# Altium schematic sheet 1_P0_MCU_extend.schdoc
size 307 x 218 mm; Symbol: Sheet-Symbol_A4; Device: Sheet-Symbol_A4; @Project Name: modular_design; @Page Count: 7; @Update Date: 2026-07-07; @Create Date: 2026-06-22; @Schematic Name: Schematic1; @Page No: 1; @Page Name: P0_MCU_extend; @Board Name: Board1; Company: 嘉立创EDA; Version: V1.0; Page Size: A4; Convert to PCB: yes; Add into BOM: yes; Title Block Position: 3; Width: 1170; Height: 825; Region Start: 1; X Region Count: 6; Y Region Count: 4; Blade Width: 10; @Create Time: 05:46:34; @Update Time: 16:45:46
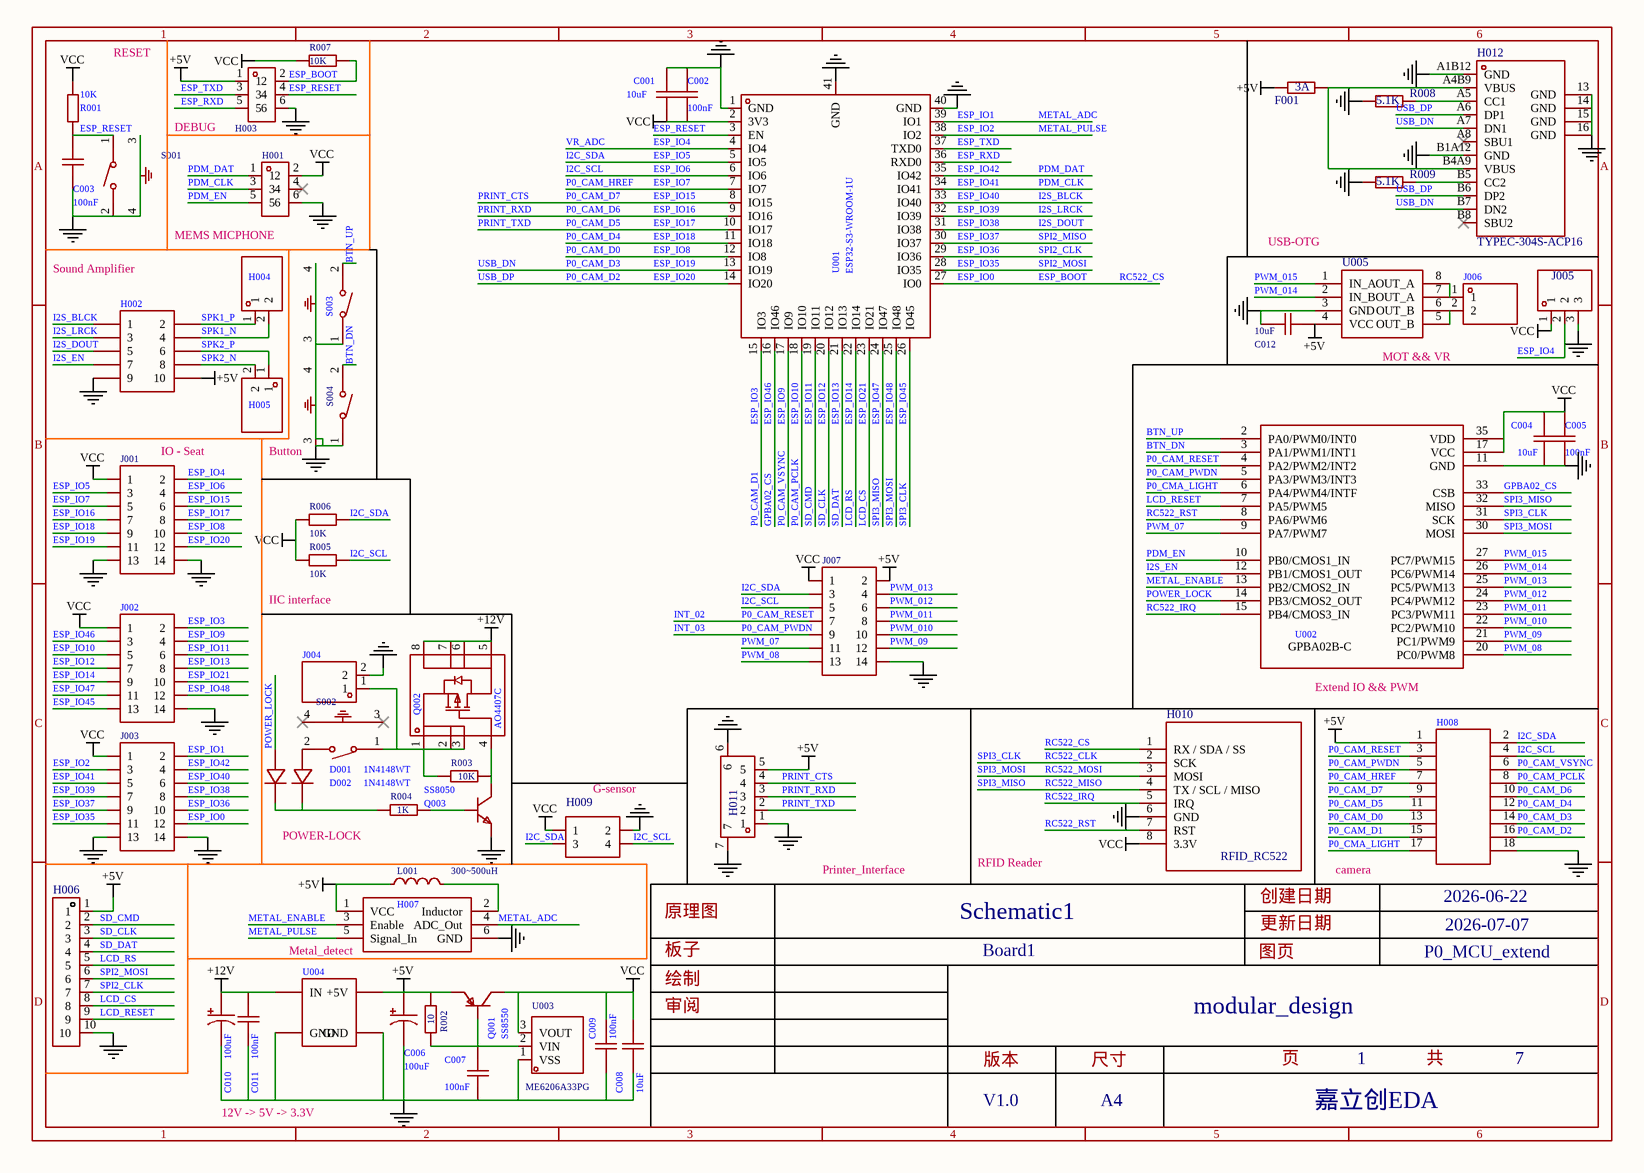
[diagram p0: 1_P0_MCU_extend.schdoc]

## Parts
C001  10uF  [C0805]
C002  100nF  [C0603]
C003  100nF  [C0603]
C004  10uF  [C0805]
C005  100nF  [C0603]
C006  100uF  [CAP-SMD_BD6.3-L6.6-W6.6-LS7.2-R-RD]
C007  100nF  [C0805]
C008  10uF  [C0805]
C009  100nF  [C0805]
C010  100uF  [CAP-SMD_BD6.3-L6.6-W6.6-LS7.2-R-RD]
C011  100nF  [C0805]
C012  10uF  [C0805]
D001  1N4148WT  [SOD-523_L1.2-W0.8-LS1.6-RD]
D002  1N4148WT  [SOD-523_L1.2-W0.8-LS1.6-RD]
F001  3A  [R0805]
H001  PZ254V-12-6P  [PDM_MODULE]  (value not drawn)
H002  (no value)  [I2S_HT517_STEREO]
H003  PZ254V-12-6P  [CH343_DEBUG]  (value not drawn)
H004  B2B-ZR(LF)(SN)  [CONN-TH_B2B-ZR-LF-SN]  (value not drawn)
H005  B2B-ZR(LF)(SN)  [CONN-TH_B2B-ZR-LF-SN]  (value not drawn)
H006  (no value)  [connector_p10_1.5mm]
H007  (no value)  [Metal_Detect]
H008  (no value)  [connector_p2*9_2.54]
H009  A2541HWV-2x2P  [SC7A20_MODULE]  (value not drawn)
H010  (no value)  [RFID_RC522]
H011  HX20007-5AWB  [CONN-SMD_5P-P2.00_HX20007-5AWB]  (value not drawn)
H012  TYPEC-304S-ACP16  [USB-C-SMD_TYPEC-304S-ACP16]
J001  2.54-2*7P母  [HDR-TH_14P-P2.54-V-F-R2-C7-S2.54-1]  (value not drawn)
J002  2.54-2*7P母  [HDR-TH_14P-P2.54-V-F-R2-C7-S2.54-1]  (value not drawn)
J003  2.54-2*7P母  [HDR-TH_14P-P2.54-V-F-R2-C7-S2.54-1]  (value not drawn)
J004  B2B-ZR(LF)(SN)  [connector_p2_2.0mm]  (value not drawn)
J005  (no value)  [conn-dip-1*3-1.5mm]
J006  B2B-ZR(LF)(SN)  [CONN-TH_B2B-ZR-LF-SN]  (value not drawn)
J007  2.54-2*7P母  [HDR-TH_14P-P2.54-V-F-R2-C7-S2.54-1]  (value not drawn)
L001  300~500uH  [connector_p2_2.0mm]
Q001  SS8550  [SOT-23-3_L2.9-W1.4-P1.90-LS2.6-BR]
Q002  AO4407C  [SOP-8_L4.9-W3.9-P1.27-LS6.0-BL]
Q003  SS8050  [SOT-23-3_L2.9-W1.3-P1.90-LS2.4-BR]
R001  10K  [R0603]
R002  10  [R0603]
R003  10K  [R0603]
R004  1K  [R0603]
R005  10K  [R0603]
R006  10K  [R0603]
R007  10K  [R0603]
R008  5.1K  [R0603]
R009  5.1K  [R0603]
S001  TC-1102N-C-A-B  [SW-TH_TC-1102N-C-A-B]  (value not drawn)
S002  TC-1102N-C-A-B  [SW-TH_TC-1102N-C-A-B]  (value not drawn)
S003  TC-1102N-C-A-B  [SW-TH_TC-1102N-C-A-B]  (value not drawn)
S004  TC-1102N-C-A-B  [SW-TH_TC-1102N-C-A-B]  (value not drawn)
U001  (no value)  [ESP32-S3-WROOM-1U]
U002  (no value)  [GPBA02B-C]
U003  ME6206A33PG  [SOT-89-3_L4.5-W2.5-P1.50-LS4.2-BR]
U004  (no value)  [CX8823_MO]
U005  (no value)  [sop-8_l5.0-w4.0-p1.27-ls6.2-bl]

## Nets
+5V: C006.1 C012.1 F001.1 H002.10 H003.1 H006.1 H007.1(VCC) H008.1 H011.5 J007.2 L001.1 Q001.2(E) R002.1 U004.2(+5V) U005.4(VCC)
+12V: C010.1 C011.2 Q002.5(D) Q002.6(D) Q002.7(D) Q002.8(D) U004.1(IN)
GND: C001.2 C002.2 C003.1 C004.1 C005.1 C006.2 C007.1 C008.1 C009.1 C010.2 C011.1 C012.2 H001.6 H002.9 H003.6 H006.10 H007.6(GND) H008.18 H009.2 H010.6(GND) H011.1 H011.6 H011.7 H012.13(GND) H012.14(GND) H012.15(GND) H012.16(GND) H012.A1B12(GND) H012.B1A12(GND) J001.13 J001.14 J002.14 J003.13 J003.14 J004.2 J005.3 J007.14 Q003.2(E) R008.1 R009.1 S001.2 S001.3 S001.4 S003.1 S003.3 S003.4 S004.1 S004.3 S004.4 U001.1(GND) U001.40(GND) U001.41(GND) U002.11(GND) U003.1(VSS) U004.3(GND) U004.4(GND) U005.3(GND)
VCC: C001.1 C002.1 C004.2 C005.2 C008.2 C009.2 H001.2 H009.1 H010.8(3.3V) J001.1 J002.1 J003.1 J005.1 J007.1 Q001.3(C) R001.2 R005.2 R006.2 R007.2 U001.2(3V3) U002.17(VCC) U002.35(VDD) U003.3(VOUT)
BTN_DN: S004.2 U002.3(PA1/PWM1/INT1)
BTN_UP: S003.2 U002.2(PA0/PWM0/INT0)
ESP_BOOT: H003.2 H010.1(RX_/_SDA_/_SS) J003.12 R007.1 U001.27(IO0)  [also labelled ESP_IO0, RC522_CS]
ESP_IO1: H007.4(ADC_Out) J003.2 U001.39(IO1)  [also labelled METAL_ADC]
ESP_IO2: H007.5(Signal_In) J003.3 U001.38(IO2)  [also labelled METAL_PULSE]
ESP_IO3: H008.15 J002.2 U001.15(IO3)  [also labelled P0_CAM_D1]
ESP_IO4: J001.2 J005.2 U001.4(IO4)  [also labelled VR_ADC]
ESP_IO5: H008.2 H009.3 J001.3 J007.3 R006.1 U001.5(IO5)  [also labelled I2C_SDA]
ESP_IO6: H008.4 H009.4 J001.4 J007.5 R005.1 U001.6(IO6)  [also labelled I2C_SCL]
ESP_IO7: H008.7 J001.5 U001.7(IO7)  [also labelled P0_CAM_HREF]
ESP_IO8: H008.13 J001.10 U001.12(IO8)  [also labelled P0_CAM_D0]
ESP_IO9: H008.6 J002.4 U001.17(IO9)  [also labelled P0_CAM_VSYNC]
ESP_IO10: H008.8 J002.5 U001.18(IO10)  [also labelled P0_CAM_PCLK]
ESP_IO11: H006.2 J002.6 U001.19(IO11)  [also labelled SD_CMD]
ESP_IO12: H006.3 J002.7 U001.20(IO12)  [also labelled SD_CLK]
ESP_IO13: H006.4 J002.8 U001.21(IO13)  [also labelled SD_DAT]
ESP_IO14: H006.5 J002.9 U001.22(IO14)  [also labelled LCD_RS]
ESP_IO15: H008.9 H011.4 J001.6 U001.8(IO15)  [also labelled P0_CAM_D7, PRINT_CTS]
ESP_IO16: H008.10 H011.3 J001.7 U001.9(IO16)  [also labelled P0_CAM_D6, PRINT_RXD]
ESP_IO17: H008.11 H011.2 J001.8 U001.10(IO17)  [also labelled P0_CAM_D5, PRINT_TXD]
ESP_IO18: H008.12 J001.9 U001.11(IO18)  [also labelled P0_CAM_D4]
ESP_IO19: H008.14 H012.A7(DN1) H012.B7(DN2) J001.11 U001.13(IO19)  [also labelled P0_CAM_D3, USB_DN]
ESP_IO20: H008.16 H012.A6(DP1) H012.B6(DP2) J001.12 U001.14(IO20)  [also labelled P0_CAM_D2, USB_DP]
ESP_IO21: H006.8 J002.10 U001.23(IO21)  [also labelled LCD_CS]
ESP_IO35: H006.6 J003.11 U001.28(IO35)  [also labelled SPI2_MOSI]
ESP_IO36: H006.7 J003.10 U001.29(IO36)  [also labelled SPI2_CLK]
ESP_IO37: J003.9 U001.30(IO37)  [also labelled SPI2_MISO]
ESP_IO38: H002.5 J003.8 U001.31(IO38)  [also labelled I2S_DOUT]
ESP_IO39: H002.3 J003.7 U001.32(IO39)  [also labelled I2S_LRCK]
ESP_IO40: H002.1 J003.6 U001.33(IO40)  [also labelled I2S_BLCK]
ESP_IO41: H001.3 J003.5 U001.34(IO41)  [also labelled PDM_CLK]
ESP_IO42: H001.1 J003.4 U001.35(IO42)  [also labelled PDM_DAT]
ESP_IO45: H010.2(SCK) J002.13 U001.26(IO45) U002.31(SCK)  [also labelled RC522_CLK, SPI3_CLK]
ESP_IO46: J002.3 U001.16(IO46) U002.33(CSB)  [also labelled GPBA02_CS]
ESP_IO47: H010.4(TX_/_SCL_/_MISO) J002.11 U001.24(IO47) U002.32(MISO)  [also labelled RC522_MISO, SPI3_MISO]
ESP_IO48: H010.3(MOSI) J002.12 U001.25(IO48) U002.30(MOSI)  [also labelled RC522_MOSI, SPI3_MOSI]
ESP_RESET: C003.2 H003.4 R001.1 S001.1 U001.3(EN)
ESP_RXD: H003.5 U001.36(RXD0)
ESP_TXD: H003.3 U001.37(TXD0)
I2S_EN: H002.7 U002.12(PB1/CMOS1_OUT)
INT_02: H008.3 J007.7 U002.4(PA2/PWM2/INT2)  [also labelled P0_CAM_RESET]
INT_03: H008.5 J007.9 U002.5(PA3/PWM3/INT3)  [also labelled P0_CAM_PWDN]
LCD_RESET: H006.9 U002.7(PA5/PWM5)
METAL_ENABLE: H007.3(Enable) U002.13(PB2/CMOS2_IN)
P0_CMA_LIGHT: H008.17 U002.6(PA4/PWM4/INTF)
PDM_EN: H001.5 U002.10(PB0/CMOS1_IN)
POWER_LOCK: D001.2(A) U002.14(PB3/CMOS2_OUT)
PWM_07: J007.11 U002.9(PA7/PWM7)
PWM_08: J007.13 U002.20(PC0/PWM8)
PWM_09: J007.12 U002.21(PC1/PWM9)
PWM_010: J007.10 U002.22(PC2/PWM10)
PWM_011: J007.8 U002.23(PC3/PWM11)
PWM_012: J007.6 U002.24(PC4/PWM12)
PWM_013: J007.4 U002.25(PC5/PWM13)
PWM_014: U002.26(PC6/PWM14) U005.2(IN_B)
PWM_015: U002.27(PC7/PWM15) U005.1(IN_A)
RC522_IRQ: H010.5(IRQ) U002.15(PB4/CMOS3_IN)
RC522_RST: H010.7(RST) U002.8(PA6/PWM6)
SPK1_N: H002.4 H004.2
SPK1_P: H002.2 H004.1
SPK2_N: H002.8 H005.2
SPK2_P: H002.6 H005.1
NetC007_2: C007.2 Q001.1(B) R002.2 U003.2(VIN)
NetD001_1: D001.1(C) D002.1(C) R004.2
NetD002_2: D002.2(A) S002.2
NetF001_2: F001.2 H012.A4B9(VBUS) H012.B4A9(VBUS)
NetH007_2: H007.2(Inductor) L001.2
NetH012_A5: H012.A5(CC1) R008.2
NetH012_B5: H012.B5(CC2) R009.2
NetJ004_1: J004.1 Q002.1(S) Q002.2(S) Q002.3(S) R003.2 S002.1
NetJ006_1: J006.1 U005.7(OUT_A) U005.8(OUT_A)
NetJ006_2: J006.2 U005.5(OUT_B) U005.6(OUT_B)
NetQ002_4: Q002.4(G) Q003.3(C) R003.1
NetQ003_1: Q003.1(B) R004.1

Not connected (* = marked no-connect by the designer): H001 4*; H012 A8(SBU1)* B8(SBU2)*; S002 3* 4*

## Notes on the sheet
- (near R001) RESET
- DEBUG
- MEMS MICPHONE
- (near U005) USB-OTG
- Sound Amplifier
- (near U005) MOT && VR
- (near J001) IO - Seat
- (near S004) Button
- (near R005) IIC interface
- (near U002) Extend IO && PWM
- (near H009) G-sensor
- POWER-LOCK
- Printer_Interface
- RFID Reader
- camera
- (near H007) Metal_detect
- 12V -> 5V -> 3.3V
- 1
- 2
- 3
- 4
- 5
- 6
- A
- B
- C
- 原理图
- Schematic1
- 创建日期
- 更新日期
- 2026-06-22
- 2026-07-07
- 绘制
- 板子
- Board1
- 图页
- P0_MCU_extend
- D
- 审阅
- 版本
- 尺寸
- modular_design
- 页
- 共
- 7
- V1.0
- A4
- 嘉立创EDA

## Library data of the parts
C001 C004 = CC0805ZKY5V7BB106: Manufacturer: YAGEO(国巨); Symbol: CapAcitance; Add into BOM: yes; Temperature Coefficient: Y5V; Tolerance: -20%~+80%; Voltage Rated: 16V; Device: CC0805ZKY5V7BB106; LCSC Part Name: 10uF -20%~+80% 16V; Supplier Part: C106836; Manufacturer Part: CC0805ZKY5V7BB106; Supplier Footprint: 0805; JLCPCB Part Class: Extended Part; Datasheet: https://atta.szlcsc.com/upload/public/pdf/source/20170523/1495533897565.pdf; Supplier: LCSC; Convert to PCB: yes; Body Length: -; Body Width: -; Body Thickness: -; Value: 10uF
C002 C003 C005 = CAP_0603: Symbol: CapAcitance; Convert to PCB: yes; Device: CAP_0603; Add into BOM: yes; Supplier Footprint: 0603; Value: 100nF
C006 C010 = VEJ101M1CTR-0605: Manufacturer: lelon(立隆); Add into BOM: yes; Tolerance: ±20%; Rated Voltage: 16V; φD: 6.3mm; L: 5.3mm; Lifetime @ Temp: 2000hrs@105℃; Symbol: VEJ101M1CTR-0605; Device: VEJ101M1CTR-0605; LCSC Part Name: 100uF ±20% 16V; Supplier Part: C164064; Manufacturer Part: VEJ101M1CTR-0605; Supplier Footprint: SMD,6.3x5.3mm; JLCPCB Part Class: Extended Part; Datasheet: https://atta.szlcsc.com/upload/public/pdf/source/20180126/C164064_15169515392981308320.pdf; Supplier: LCSC; Convert to PCB: yes; Value: 100uF; Ripple Current: -; Equivalent Series Resistance(ESR): -; Operating Temperature: -45℃~+105℃; Origin Footprint: CAP-SMD_BD6.3-L6.6-W6.6-LS7.2-R-RD
C007 C008 C009 C011 C012 = CAP_0603: Convert to PCB: yes; Origin Footprint: C0603; Symbol: CAP_0603; Device: CAP_0603; Add into BOM: yes; Supplier Footprint: 0603
  C007 C009 C011: Value: 100nF
  C008 C012: Value: 10uF
D001 D002 = 1N4148WT: Manufacturer: onsemi(安森美); Symbol: 1N4148WT_C232841; Add into BOM: yes; Diode Configuration: 独立式; Power Dissipation: 200mW; Reverse Voltage (Vr): 75V; Average Rectified Current (Io): 300mA; Forward Voltage (Vf@If): 1V@10mA; Reverse Leakage Current: 5μA@75V; Reverse Recovery Time (trr): 4ns; Device: 1N4148WT; LCSC Part Name: 75V 300mA 4ns; Supplier Part: C232841; Manufacturer Part: 1N4148WT; Supplier Footprint: SOD-523F; JLCPCB Part Class: Extended Part; Datasheet: https://atta.szlcsc.com/upload/public/pdf/source/20181222/C232841_42C5BA49E5A441BB8F6B91D0F4CD0D51.pdf; Supplier: LCSC; Convert to PCB: yes; Operating Temperature: -55℃~+150℃@(Tj)
F001 R008 R009 = Res_0603: Symbol: 电阻; Convert to PCB: yes; Value: 10K; Device: Res_0603; Add into BOM: yes; Supplier Footprint: 0603
H001 H003 = PZ254V-12-6P: Manufacturer: XFCN(兴飞); Add into BOM: yes; Pitch: 2.54mm; Pin Structure: 2x3P; Circluar Pins/Square Pins: 方针; Symbol: PZ254V-12-6P; Device: PZ254V-12-6P; LCSC Part Name: 2.54mm 2x3P 直插 方针; Supplier Part: C492420; Manufacturer Part: PZ254V-12-6P; Supplier Footprint: 插件,P=2.54mm; JLCPCB Part Class: Extended Part; Datasheet: https://atta.szlcsc.com/upload/public/pdf/source/20200309/C492420_BAECB307B001054C09D200388220EAE6.pdf; Supplier: LCSC; Convert to PCB: yes; Number of Pins: 6; Number of Rows: 2; Row Spacing: 2.54mm; Mounting Type: 直插; Current Rating (Max): -; Voltage Rating (Max): -; Length of Mating Pin: 6mm; Insulation Height: 2.5mm; Length of End Connection Pin: 3mm; Contact Material: 黄铜; Contact Plating: -; Operating Temperature Range: -40℃~+105℃; Color: 黑色
H002 = Finger_2*5: Add into BOM: yes; Symbol: Finger_2*5; Device: Finger_2*5; Convert to PCB: yes
H004 H005 J004 J006 = B2B-ZR(LF)(SN): Manufacturer: JST; Add into BOM: yes; Pitch: 1.5mm; Pins Structure: 1x2P; Number of PINs Per Row: 2; Symbol: B2B-ZR (LF)(SN); Device: B2B-ZR(LF)(SN); LCSC Part Name: B2B-ZR (LF)(SN); Supplier Part: C158011; Manufacturer Part: B2B-ZR(LF)(SN); Supplier Footprint: 插件,P=1.5mm; JLCPCB Part Class: Extended Part; Datasheet: https://atta.szlcsc.com/upload/public/pdf/source/20181223/C158011_6CFD0C70F58E1854900B8AF425FE5444.pdf; Supplier: LCSC; Convert to PCB: yes; Reference Series: -; Number of Rows: 1; Row Spacing: -; Mounting Style: -; Contact Material: 黄铜
H006 = connector_p10_1.5mm: Add into BOM: yes; Symbol: connector_p10_1.5mm; Device: connector_p10_1.5mm; Convert to PCB: yes
H007 = Metal_Detect: Add into BOM: yes; Symbol: Metal_Detect; Device: Metal_Detect; Convert to PCB: yes
H008 = conn-2*9p: Add into BOM: yes; Symbol: conn-2*9p; Device: conn-2*9p; Convert to PCB: yes
H009 = A2541HWV-2x2P: Manufacturer: CJT(长江连接器); Add into BOM: yes; Pitch: 2.54mm; Number of Holes: 4; Holes Structure: 2x2P; Symbol: A2541HWV-2X2P; Device: A2541HWV-2x2P; LCSC Part Name: 2.54mm 2x2P; Supplier Part: C239342; Manufacturer Part: A2541HWV-2x2P; Supplier Footprint: 直插,P=2.54mm; JLCPCB Part Class: Extended Part; Datasheet: https://atta.szlcsc.com/upload/public/pdf/source/20180724/C239342_948074203011CE30B776F48EA8B1A8F2.pdf; Supplier: LCSC; Convert to PCB: yes; Number of Rows: 2; Row Spacing: 2.54mm; Mounting Type: 直插; Insulation Height: -; Contact Material: 黄铜; Contact Plating: 金
H010 = RFID_RC522: Add into BOM: yes; Symbol: RFID_RC522; Device: RFID_RC522; Convert to PCB: yes; Origin Footprint: RFID_RC522
H011 = HX20007-5AWB: Manufacturer: HX(红星); Add into BOM: yes; Reference Series: PH; Pitch: 2mm; Pins Structure: 1x5P; Number of PINs Per Row: 5; Gender: 公型插针; Symbol: HX20007-5AWB; Device: HX20007-5AWB; LCSC Part Name: 母座 卧贴 2.0mm 5Pin位 母座; Supplier Part: C442225; Manufacturer Part: HX20007-5AWB; Supplier Footprint: SMD,P=2mm; JLCPCB Part Class: Extended Part; Datasheet: https://atta.szlcsc.com/upload/public/pdf/source/20191028/C442225_DDD2455535F7EA1D3D205E5EFB10C902.pdf; Supplier: LCSC; Convert to PCB: yes; Number of Rows: 1; Row Spacing: -; Mounting Style: 卧贴; Current Rating (Max): -; Operating Temperature Range: -; Origin Footprint: CONN-SMD_5P-P2.00_HX20007-5AWB
H012 = TYPEC-304S-ACP16: Manufacturer: XUNPU(讯普); Add into BOM: yes; Connector Type: Type-C; Gender: 母座; Number of Contacts: 16; Number of Ports: 1; Current Rating - Power (Max): 3A; Welding Temperature (Max): 260℃; Symbol: TYPEC-304S-ACP16; Device: TYPEC-304S-ACP16; LCSC Part Name: Type-C 母座 卧贴; Supplier Part: C720630; Manufacturer Part: TYPEC-304S-ACP16; Supplier Footprint: SMD; JLCPCB Part Class: Extended Part; Datasheet: https://atta.szlcsc.com/upload/public/pdf/source/20200812/C720630_4E8E536EF3694A171163775BA200E634.pdf; Supplier: LCSC; Convert to PCB: yes; Standard: USB 3.1; Mounting Style: 卧贴; Operating Temperature Range: -45℃~+85℃
J001 J002 J003 J007 = 2.54-2*7P母: Manufacturer: BOOMELE(博穆精密); Symbol: Header-Female-2.54_2x7; Add into BOM: yes; Pitch: 2.54mm; Number of Holes: 14; Holes Structure: 2x7P; Device: 2.54-2*7P母; LCSC Part Name: 2.54mm 2x7P; Supplier Part: C38844; Manufacturer Part: 2.54-2*7P母; Supplier Footprint: 直插,P=2.54mm; JLCPCB Part Class: Extended Part; Datasheet: https://atta.szlcsc.com/upload/public/pdf/source/20151109/1457707558102.pdf; Supplier: LCSC; Convert to PCB: yes; Number of Rows: 2; Row Spacing: 2.54mm; Mounting Type: 直插; Insulation Height: -; Contact Material: 黄铜; Contact Plating: -
J005 = conn-1*3p: Add into BOM: yes; Symbol: conn-1*3p; Device: conn-1*3p; Convert to PCB: yes
L001 = CKL0514-470uH/J-CCA T: Manufacturer: CENKER(岑科); Add into BOM: yes; Type: 色环电感; Value: 470uH; Tolerance: ±5%; Rated Current: 280mA; DC Resistance: 3.22Ω; Origin Footprint: CONN-TH_2P-P3.81_KF2EDGV-3.81-2P; Symbol: CKL0514-470uH/J-CCA T; Device: CKL0514-470uH/J-CCA T; LCSC Part Name: 470uH ±5% 280mA 3.22Ω; Supplier Part: C354673; Manufacturer Part: CKL0514-470uH/J-CCA T; Supplier Footprint: 轴向引线; JLCPCB Part Class: Extended Part; Datasheet: https://atta.szlcsc.com/upload/public/pdf/source/20190315/C354673_825EB25F3EB411343FC5F933A0BC0339.pdf; Supplier: LCSC; Convert to PCB: yes; Q @ Frequency: -; Frequency - Self Resonant: -
Q001 = SS8550: Manufacturer: TWGMC(台湾迪嘉); Symbol: SS8550_C727138; Add into BOM: yes; Transistor Type: PNP; Collector-Emitter Breakdown Voltage (Vceo): 25V; Collector Current (Ic): 1.5A; Power Dissipation (Pd): 300mW; Collector-Emitter Saturation Voltage (VCE(sat)@Ic,Ib): 500mV@800mA,80mA; DC Current Gain (hFE@Ic,Vce): 200@100mA,1V; Transition Frequency (fT): 100MHz; Device: SS8550; LCSC Part Name: SS8550; Supplier Part: C727138; Manufacturer Part: SS8550; Supplier Footprint: SOT-23; JLCPCB Part Class: Extended Part; Datasheet: https://atta.szlcsc.com/upload/public/pdf/source/20200827/C727138_BA615C6C75A6E3189106DA068B2571C1.pdf; Supplier: LCSC; Convert to PCB: yes; Operating Temperature: +150℃@(Tj)
Q002 = AO4407C: Manufacturer: AOS; Add into BOM: yes; Type: P沟道; Drain Source Voltage (Vdss): 30V; Continuous Drain Current (Id): 14A; Power Dissipation (Pd): 3.1W; Drain Source On Resistance (RDS(on)@Vgs,Id): 11.5mΩ@10V,14A; Gate Threshold Voltage (Vgs(th)@Id): 2.3V@250μA; Symbol: AO4407C; Device: AO4407C; LCSC Part Name: P沟道 30V 14A 产地：重庆; Supplier Part: C469397; Manufacturer Part: AO4407C; Supplier Footprint: SOP-8; JLCPCB Part Class: Extended Part; Datasheet: https://atta.szlcsc.com/upload/public/pdf/source/20191212/C469397_0FA240FA8DBDAEB8A8E95B002A232449.pdf; Supplier: LCSC; Convert to PCB: yes
Q003 = SS8050: Manufacturer: CJ（江苏长电/长晶）; Add into BOM: yes; Transistor Type: NPN; Collector-Emitter Breakdown Voltage (Vceo): 25V; Collector Current (Ic): 1.5A; Power Dissipation (Pd): 300mW; Collector-Emitter Saturation Voltage (VCE(sat)@Ic,Ib): 500mV@800mA,80mA; DC Current Gain (hFE@Ic,Vce): 200@100mA,1V; Transition Frequency (fT): 100MHz; Symbol: SS8050; Device: SS8050; LCSC Part Name: SS8050 Y1 200-350 Y1 200-350; Supplier Part: C2150; Manufacturer Part: SS8050; Supplier Footprint: SOT-23(SOT-23-3); JLCPCB Part Class: Basic Part; Datasheet: https://atta.szlcsc.com/upload/public/pdf/source/20140809/1457707209319.pdf; Supplier: LCSC; Convert to PCB: yes; Operating Temperature: +150℃@(Tj); Origin Footprint: SOT-23-3_L2.9-W1.3-P1.90-LS2.4-BR
R001 R003 R005 R006 R007 = Res_0603: Convert to PCB: yes; Symbol: Res_0603; Device: Res_0603; Add into BOM: yes; Supplier Footprint: 0603; Value: 10K; Origin Footprint: R0603
R002 R004 = Res_0603: Convert to PCB: yes; Value: 10K; Symbol: Res_0603; Device: Res_0603; Add into BOM: yes; Supplier Footprint: 0603; Origin Footprint: R0603
S001 S002 S003 S004 = TC-1102N-C-A-B: Manufacturer: XKB Connectivity(中国星坤); Add into BOM: yes; Contact Current: 50mA; Voltage Rating (DC): 12V; Insulation Resistance: 100mΩ; Circuit: 单刀单掷; Actuator Style: 圆形按钮; Actuator/Cap Color: 黑色; With Lamp: 无; Operating Force: 260gf; Mechanical Life: 300000; Pin Style: PC引脚; Switch Length: 6mm; Switch Height: 5mm; Strike Gundam: 是; Symbol: TC-1102N-C-A-B; Device: TC-1102N-C-A-B; LCSC Part Name: 6*6*5.0带支架 侧边按键 力度260gf 高寿命; Supplier Part: C406152; Manufacturer Part: TC-1102N-C-A-B; Supplier Footprint: 插件; JLCPCB Part Class: Extended Part; Datasheet: https://atta.szlcsc.com/upload/public/pdf/source/20211011/8943A334D21548136505FDDC6F7285B9.pdf; Supplier: LCSC; Convert to PCB: yes; Mounting Style: 卧插; Operating Temperature: -30℃~+85℃; Switch Width: 6mm; Origin Footprint: SW-TH_TC-1102N-C-A-B
U001 = ESP32-S3-WROOM-1U: Add into BOM: yes; Symbol: ESP32-S3-WROOM-1U; Device: ESP32-S3-WROOM-1U; Convert to PCB: yes
U002 = GPBA02B-C: Add into BOM: yes; Symbol: GPBA02B-C; Device: GPBA02B-C; Convert to PCB: yes
U003 = ME6209A33PG: Manufacturer: MICRONE(南京微盟); Add into BOM: yes; Output Type: 固定; Output Polarity: 正; Number of Outputs: 1; Maximum Input Voltage: 18V; Output Voltage: 3.3V; Dropout Voltage: 80mV@(40mA); Output Current: 250mA; Symbol: ME6209A33PG; Device: ME6209A33PG; LCSC Part Name: Vin=18V Vout=3.3V 250mA; Supplier Part: C80222; Manufacturer Part: ME6209A33PG; Supplier Footprint: SOT-89(SOT-89-3); JLCPCB Part Class: Extended Part; Datasheet: https://atta.szlcsc.com/upload/public/pdf/source/20160903/1472896599532.pdf; Supplier: LCSC; Convert to PCB: yes; Power Supply Rejection Ratio (PRSS): -; Origin Footprint: SOT-89-3_L4.5-W2.5-P1.50-LS4.2-BR
U004 = CX8823_5V: Add into BOM: yes; Symbol: CX8823_5V; Device: CX8823_5V; Convert to PCB: yes
U005 = AM2837: Add into BOM: yes; Symbol: AM2837; Device: AM2837; Convert to PCB: yes